# EAGLE design ai_firefly (EAGLE 6.5.0)
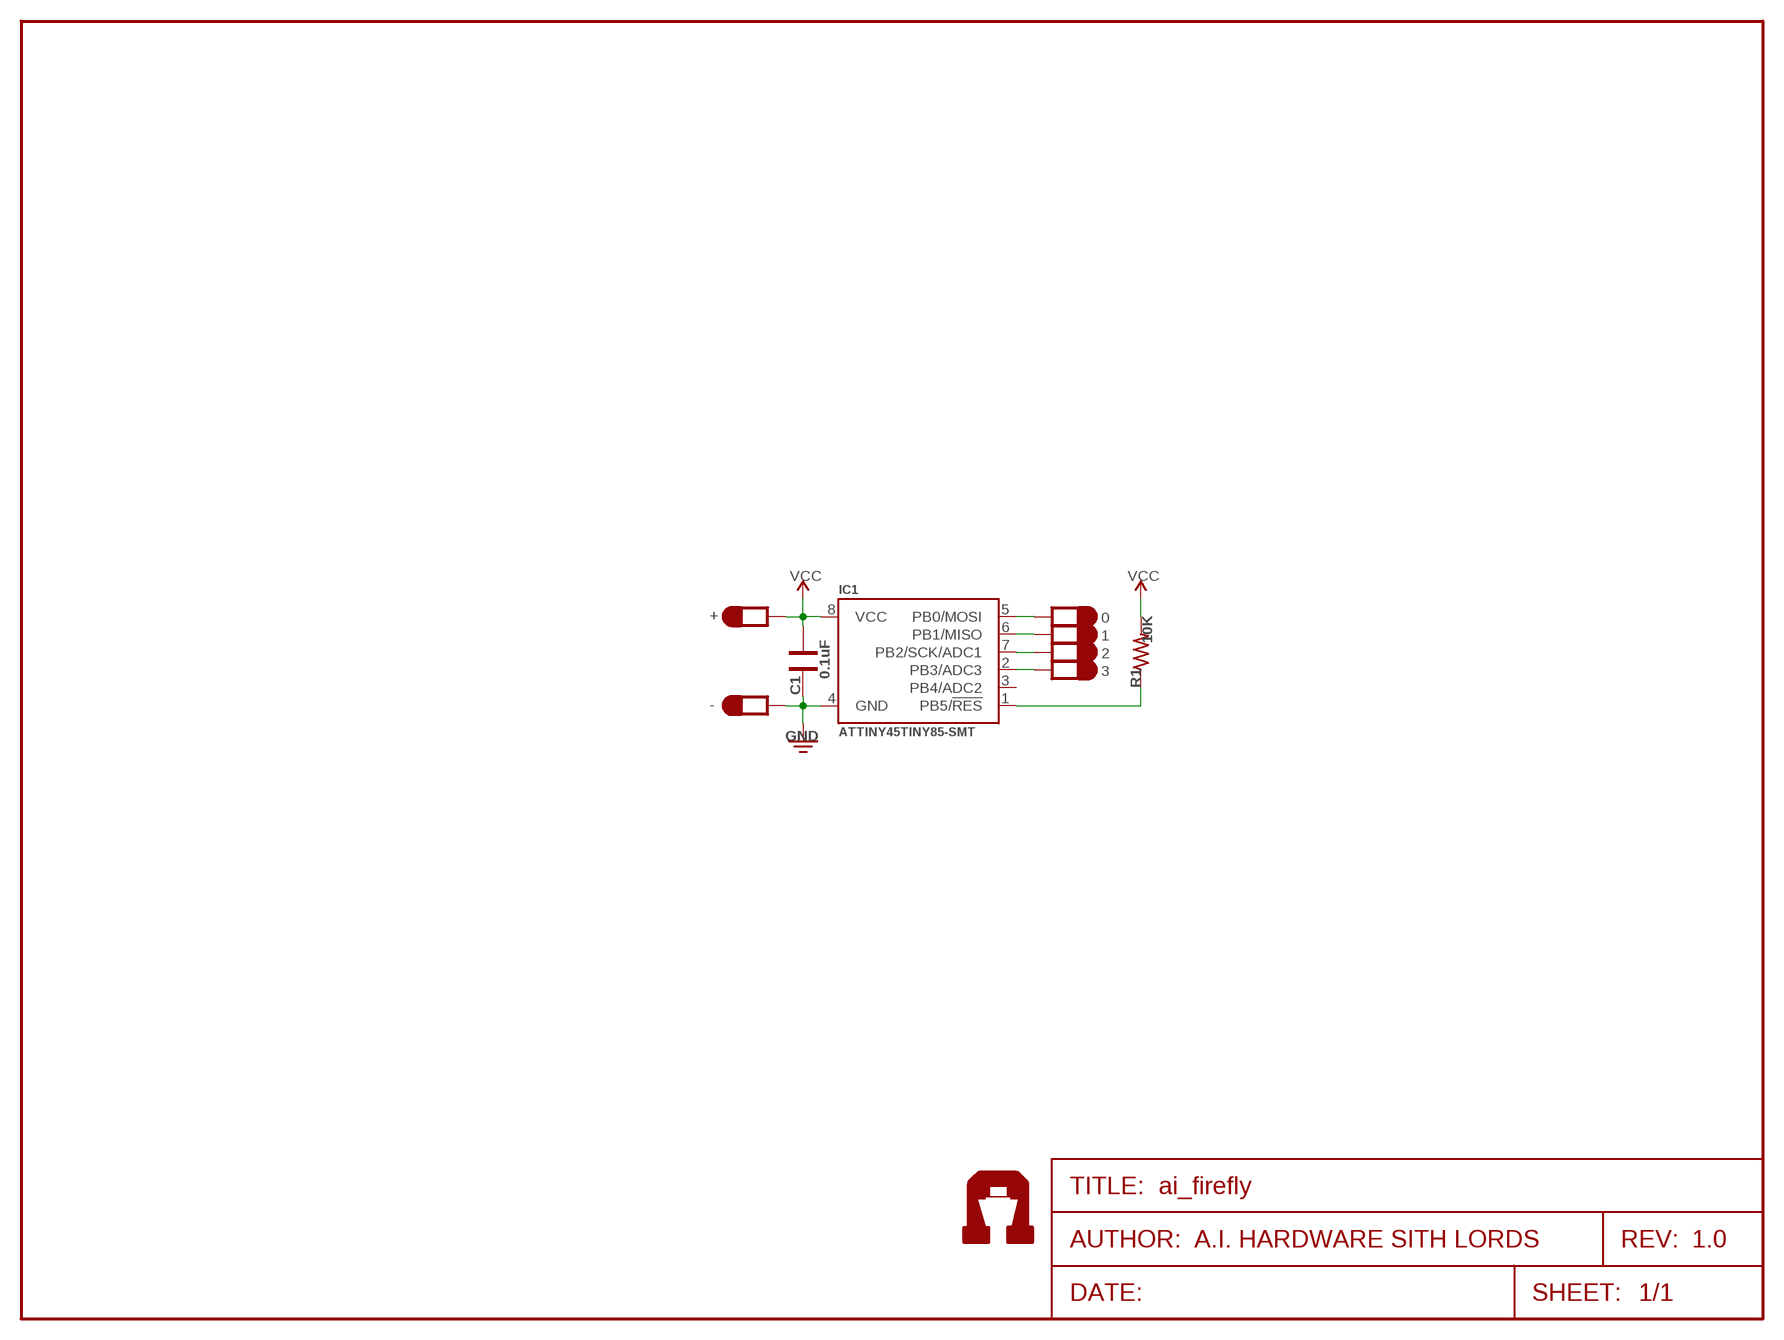
[diagram p0: schematic, sheet 1]
FRAME1 (FRAME-LETTER): AUTHOR: A.I. HARDWARE SITH LORDS; REV: 1.0

## Parts
0  1X01-PETAL  [1X01-PETAL]
1  1X01-PETAL  [1X01-PETAL]
2  1X01-PETAL  [1X01-PETAL]
3  1X01-PETAL  [1X01-PETAL]
+  1X01-PETAL  [1X01-PETAL]
-  1X01-PETAL  [1X01-PETAL]
C1  0.1uF  CAP0603  [CAP-0603]
IC1  ATTINY45TINY85-SMT  [S008-EIAJ]
R1  10K  RES0603  [RES-0603]
U$9  AI-LOGOXS  [AI-LOGO-XS]

## Nets
0: 0.1 IC1.5(PB0/MOSI)
1: 1.1 IC1.6(PB1/MISO)
2: 2.1 IC1.7(PB2/SCK/ADC1)
3: 3.1 IC1.2(PB3/ADC3)
GND: -.1 C1.2 IC1.4(GND)
RES: IC1.1(PB5/!RES) R1.1
VCC: +.1 C1.1 IC1.8(VCC) R1.2
Unconnected: IC1.3(PB4/ADC2)

## Library data of the parts
0 1-3 + - = Ai_Connectors:1X01-PETAL
C1 = Ai_Passives:CAP
IC1 = Ai_IC:ATTINY45: Atmel's 8-pin 2/4/8kB flash family of microcontrollers
R1 = Ai_Passives:RES: Part # blah Digikey
U$9 = Ai_Miscellany:AI-LOGO

## Net classes
0 default: width 0.254 mm
1 PWR: width 0.305 mm

## Board
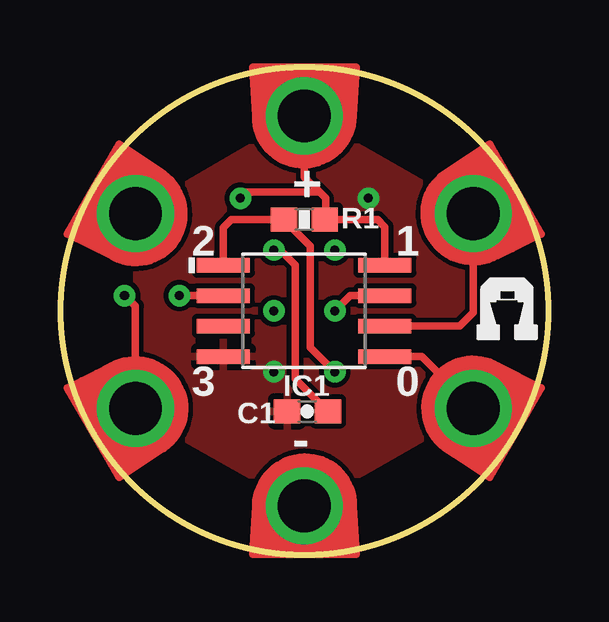
[diagram p1: board, top side]
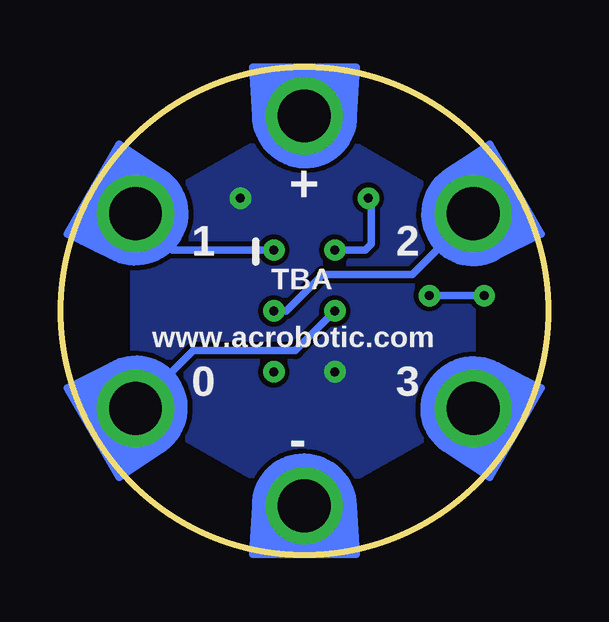
[diagram p2: board, bottom side, seen from below]

Size 20.32 x 20.32 mm. Coordinates in mm from the lower left corner, seen from the top.
Outline: circle at 10.16,10.16 radius 10.16
Copper layers (1*16): Top 0.035mm / dielectric 1.5mm / Bottom 0.035mm
Design rules "ai_2layer_qfn": minimum track width 7mil, minimum drill 15mil, track to track 8mil, track to pad 8mil, pad to pad 8mil, via to via 8mil, smd to smd 8mil, copper to edge 8mil, drill to drill 8mil, minimum pad ring 1mil, minimum via ring 10mil, stop-mask expansion 4mil, vias tented up to drill 20mil, thermal gap 10mil

### Footprints (pad centres in the part's own frame; a part is rotated, then mirrored left to right if it is on the bottom)
1X01-PETAL = drill 2.2: 1 0,0
CAP-0603 = smd 1.1 x 1: 1 -0.85,0; 2 0.85,0
S008-EIAJ = smd 0.61 x 2.21: 1 -1.905,-3.378; 2 -0.635,-3.378; 3 0.635,-3.378; 4 1.905,-3.378; 5 1.905,3.353; 6 0.635,3.353; 7 -0.635,3.353; 8 -1.905,3.353
RES-0603 = smd 1.1 x 1: 1 -0.85,0; 2 0.85,0

### Placement (x,y rotation side)
0  17.2,6.1 240 top
1  17.2,14.22 300 top
2  3.12,14.22 60 top
3  3.12,6.1 120 top
+  10.16,18.29 0 top
-  10.16,2.03 180 top
C1  10.29,5.97 180 top
IC1  10.16,10.16 270 top
R1  10.16,13.97 0 top
U$9  17.27,8.89 0 top

### Tracks (layer width: path | path; a pad name or v marks a point on that pad's centre or on a via)
0  (via drill 0.38)
  Top 0.305: IC1.5 15.04,8.26 0.1
  Bottom 0.305: v8.89,10.16 10.54,8.51 14.79,8.51 0.1
1  (via drill 0.38)
  Top 0.305: IC1.6 16.64,9.53 17.2,10.09 1.1
  Bottom 0.305: v11.43,12.7 15.68,12.7 1.1
2  (via drill 0.38)
  Top 0.305: v11.43,10.16 12.06,10.79 IC1.7
  Bottom 0.305: 2.1 5.66,11.68 9.4,11.68 10.92,10.16 v11.43,10.16
3  (via drill 0.38)
  Top 0.305: 3.1 3.12,10.36 v2.67,10.79 | v4.95,10.79 IC1.2
  Bottom 0.305: v2.67,10.79 v4.95,10.79
GND  (via drill 0.38)
  other vias: 8.89,7.62 12.83,14.86
  pour Top: 3.17,14.22 3.17,5.97 10.16,2.03 17.27,6.1 17.27,14.22 10.16,18.29
  pour Bottom: 3.17,14.22 3.17,5.97 10.16,2.03 17.27,6.1 17.27,14.22 10.16,18.29
RES  (via drill 0.38)
  Top 0.305: IC1.1 6.78,13.64 7.11,13.97 R1.1 10.41,12.87 10.41,8.64 v11.43,7.62
VCC  (via drill 0.38)
  Top 0.305: C1.1 9.78,7.33 9.78,12.06 9.14,12.7 v8.89,12.7 | IC1.8 13.51,13.66 13.21,13.97 R1.2 11.05,14.01 11.05,14.86 10.79,15.11 | 10.79,15.11 7.75,15.11 v7.49,14.86 | +.1 10.16,15.75 10.79,15.11
  Bottom 0.305: v8.89,12.7 7.62,12.7 7.37,12.95 7.37,14.86 v7.49,14.86

### Text on the board
tPlace: + | 2 | 1 | 3 | 0 | -
bPlace: + | 2 | 1 | TBA | www.acrobotic.com | 3 | 0 | -